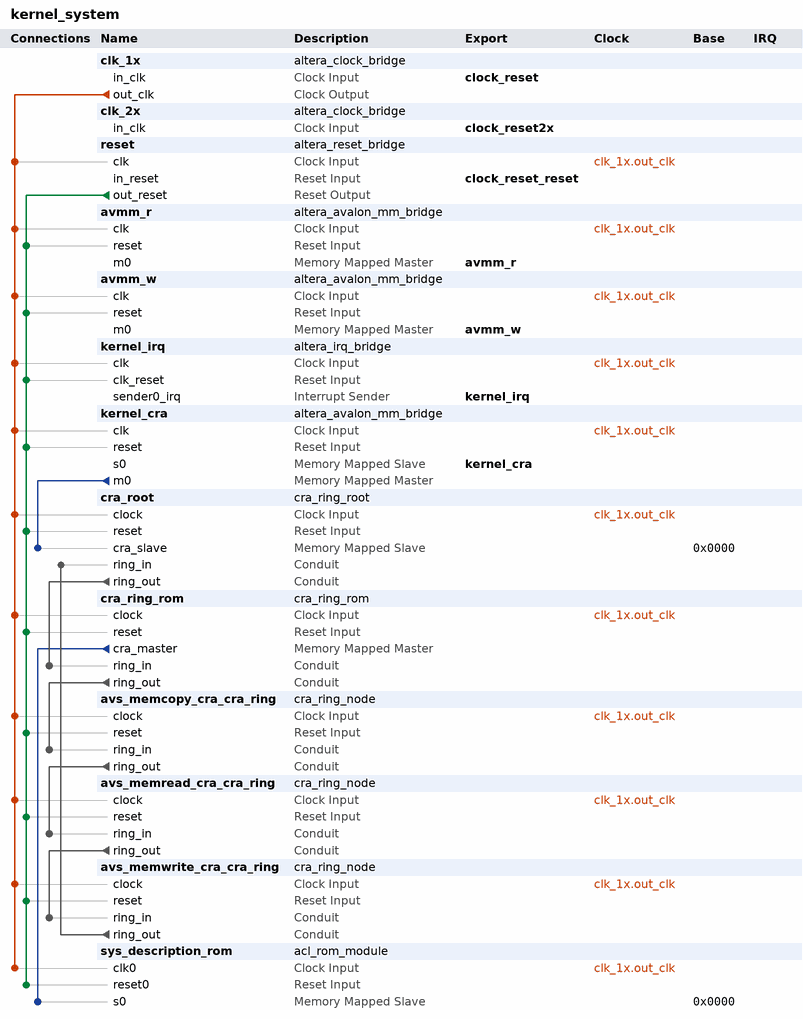
[diagram p0: system contents]
# Platform Designer (Qsys) system kernel_system, Arria 10 10AS066H1F34E1SG
# Parameters at their usual value, and those the tool derives, are not listed.
package require -exact qsys 16.0
create_system kernel_system
set_project_property DEVICE_FAMILY {Arria 10}
set_project_property DEVICE 10AS066H1F34E1SG

add_instance clk_1x altera_clock_bridge 16.0
set_instance_parameter_value clk_1x DERIVED_CLOCK_RATE 0
set_instance_parameter_value clk_1x EXPLICIT_CLOCK_RATE 0

add_instance clk_2x altera_clock_bridge 16.0
set_instance_parameter_value clk_2x DERIVED_CLOCK_RATE 0
set_instance_parameter_value clk_2x EXPLICIT_CLOCK_RATE 0

add_instance reset altera_reset_bridge 16.0
set_instance_parameter_value reset ACTIVE_LOW_RESET 1
set_instance_parameter_value reset SYNCHRONOUS_EDGES deassert

add_instance avmm_r altera_avalon_mm_bridge 16.0
set_instance_parameter_value avmm_r ADDRESS_UNITS SYMBOLS
set_instance_parameter_value avmm_r ADDRESS_WIDTH 48
set_instance_parameter_value avmm_r DATA_WIDTH 512
set_instance_parameter_value avmm_r MAX_BURST_SIZE 16
set_instance_parameter_value avmm_r MAX_PENDING_RESPONSES 64
set_instance_parameter_value avmm_r USE_AUTO_ADDRESS_WIDTH 0

add_instance avmm_w altera_avalon_mm_bridge 16.0
set_instance_parameter_value avmm_w ADDRESS_UNITS SYMBOLS
set_instance_parameter_value avmm_w ADDRESS_WIDTH 48
set_instance_parameter_value avmm_w DATA_WIDTH 512
set_instance_parameter_value avmm_w MAX_BURST_SIZE 16
set_instance_parameter_value avmm_w MAX_PENDING_RESPONSES 64
set_instance_parameter_value avmm_w USE_AUTO_ADDRESS_WIDTH 0

add_instance kernel_irq altera_irq_bridge 16.0
set_instance_parameter_value kernel_irq IRQ_WIDTH 1

add_instance kernel_cra altera_avalon_mm_bridge 16.0
set_instance_parameter_value kernel_cra ADDRESS_UNITS SYMBOLS
set_instance_parameter_value kernel_cra ADDRESS_WIDTH 30
set_instance_parameter_value kernel_cra DATA_WIDTH 64
set_instance_parameter_value kernel_cra MAX_PENDING_RESPONSES 1
set_instance_parameter_value kernel_cra PIPELINE_COMMAND 0
set_instance_parameter_value kernel_cra PIPELINE_RESPONSE 0
set_instance_parameter_value kernel_cra USE_AUTO_ADDRESS_WIDTH 0

add_instance cra_root cra_ring_root 1.0
set_instance_parameter_value cra_root ADDR_W 4
set_instance_parameter_value cra_root DATA_W 64
set_instance_parameter_value cra_root ID_W 2
set_instance_parameter_value cra_root ROM_ENABLE 1
set_instance_parameter_value cra_root ROM_EXT_W 0

add_instance cra_ring_rom cra_ring_rom 1.0
set_instance_parameter_value cra_ring_rom DATA_W 64
set_instance_parameter_value cra_ring_rom ID_W 2
set_instance_parameter_value cra_ring_rom RING_ADDR_W 4
set_instance_parameter_value cra_ring_rom ROM_EXT_W 0
set_instance_parameter_value cra_ring_rom ROM_W 5

add_instance avs_memcopy_cra_cra_ring cra_ring_node 1.0
set_instance_parameter_value avs_memcopy_cra_cra_ring CRA_ADDR_W 4
set_instance_parameter_value avs_memcopy_cra_cra_ring DATA_W 64
set_instance_parameter_value avs_memcopy_cra_cra_ring ID 0
set_instance_parameter_value avs_memcopy_cra_cra_ring ID_W 2
set_instance_parameter_value avs_memcopy_cra_cra_ring RING_ADDR_W 4

add_instance avs_memread_cra_cra_ring cra_ring_node 1.0
set_instance_parameter_value avs_memread_cra_cra_ring CRA_ADDR_W 4
set_instance_parameter_value avs_memread_cra_cra_ring DATA_W 64
set_instance_parameter_value avs_memread_cra_cra_ring ID 1
set_instance_parameter_value avs_memread_cra_cra_ring ID_W 2
set_instance_parameter_value avs_memread_cra_cra_ring RING_ADDR_W 4

add_instance avs_memwrite_cra_cra_ring cra_ring_node 1.0
set_instance_parameter_value avs_memwrite_cra_cra_ring CRA_ADDR_W 4
set_instance_parameter_value avs_memwrite_cra_cra_ring DATA_W 64
set_instance_parameter_value avs_memwrite_cra_cra_ring ID 2
set_instance_parameter_value avs_memwrite_cra_cra_ring ID_W 2
set_instance_parameter_value avs_memwrite_cra_cra_ring RING_ADDR_W 4

add_instance sys_description_rom acl_rom_module 1.0
set_instance_parameter_value sys_description_rom ADDRESS_WIDTH 5
set_instance_parameter_value sys_description_rom DATA_WIDTH 64
set_instance_parameter_value sys_description_rom INIT_FILE sys_description.hex

# connections
add_connection clk_1x.out_clk avmm_r.clk clock
add_connection clk_1x.out_clk avmm_w.clk clock
add_connection clk_1x.out_clk avs_memcopy_cra_cra_ring.clock clock
add_connection clk_1x.out_clk avs_memread_cra_cra_ring.clock clock
add_connection clk_1x.out_clk avs_memwrite_cra_cra_ring.clock clock
add_connection clk_1x.out_clk cra_ring_rom.clock clock
add_connection clk_1x.out_clk cra_root.clock clock
add_connection clk_1x.out_clk kernel_cra.clk clock
add_connection clk_1x.out_clk kernel_irq.clk clock
add_connection clk_1x.out_clk reset.clk clock
add_connection clk_1x.out_clk sys_description_rom.clk0 clock
add_connection reset.out_reset avmm_r.reset reset
add_connection reset.out_reset avmm_w.reset reset
add_connection reset.out_reset avs_memcopy_cra_cra_ring.reset reset
add_connection reset.out_reset avs_memread_cra_cra_ring.reset reset
add_connection reset.out_reset avs_memwrite_cra_cra_ring.reset reset
add_connection reset.out_reset cra_ring_rom.reset reset
add_connection reset.out_reset cra_root.reset reset
add_connection reset.out_reset kernel_cra.reset reset
add_connection reset.out_reset kernel_irq.clk_reset reset
add_connection reset.out_reset sys_description_rom.reset0 reset
add_connection cra_ring_rom.cra_master sys_description_rom.s0 avalon
set_connection_parameter_value cra_ring_rom.cra_master/sys_description_rom.s0 baseAddress 0x0000
add_connection kernel_cra.m0 cra_root.cra_slave avalon
set_connection_parameter_value kernel_cra.m0/cra_root.cra_slave baseAddress 0x0000
add_connection avs_memcopy_cra_cra_ring.ring_out avs_memread_cra_cra_ring.ring_in conduit
add_connection avs_memread_cra_cra_ring.ring_out avs_memwrite_cra_cra_ring.ring_in conduit
add_connection avs_memwrite_cra_cra_ring.ring_out cra_root.ring_in conduit
add_connection cra_ring_rom.ring_out avs_memcopy_cra_cra_ring.ring_in conduit
add_connection cra_root.ring_out cra_ring_rom.ring_in conduit

# exported interfaces
add_interface avmm_r avalon master
set_interface_property avmm_r EXPORT_OF avmm_r.m0
add_interface avmm_w avalon master
set_interface_property avmm_w EXPORT_OF avmm_w.m0
add_interface clock_reset clock sink
set_interface_property clock_reset EXPORT_OF clk_1x.in_clk
add_interface clock_reset2x clock sink
set_interface_property clock_reset2x EXPORT_OF clk_2x.in_clk
add_interface clock_reset_reset reset sink
set_interface_property clock_reset_reset EXPORT_OF reset.in_reset
add_interface kernel_cra avalon slave
set_interface_property kernel_cra EXPORT_OF kernel_cra.s0
add_interface kernel_irq interrupt sender
set_interface_property kernel_irq EXPORT_OF kernel_irq.sender0_irq

set_interconnect_requirement {$system} qsys_mm.clockCrossingAdapter HANDSHAKE
set_interconnect_requirement {$system} qsys_mm.maxAdditionalLatency 0

save_system kernel_system.qsys
